# Altium schematic sheet USB.SchDoc
size A4
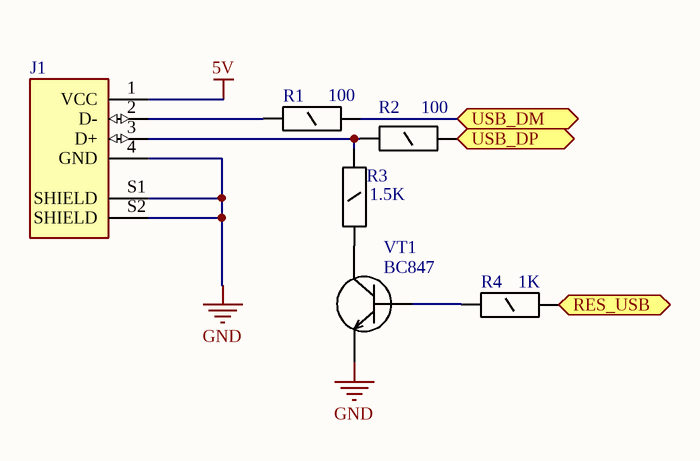
[diagram p0: USB.SchDoc]

## Parts
J1  USBB  [SAMTEC_USB-B-S-X-X-TH]  (value not drawn)
R1  100  [R_1206]
R2  100  [R_1206]
R3  1.5K  [R_1206]
R4  1K  [R_1206]
VT1  BC847  [SOT23]

## Ports
RES_USB, USB_DM, USB_DP

## Nets
5V: J1.1(VCC)
GND: J1.4(GND) J1.S1(SHIELD) J1.S2(SHIELD) VT1.2(E)
RES_USB: R4.1 ; port RES_USB
USB_DM: R1.1 ; port USB_DM
USB_DP: R2.1 ; port USB_DP
NetJ1_2: J1.2(D-) R1.2
NetJ1_3: J1.3(D+) R2.2 R3.1
NetR3_2: R3.2 VT1.3(K)
NetR4_2: R4.2 VT1.1(B)

## Library data of the parts
J1 = USB-B-S-X-X-TH: USB-B (USB TYPE-B) USB 2.0 Receptacle Connector 4 Position Through Hole, Right Angle; MF: Samtec; MP: USBB; Availability: Unavailable; Package: None; SnapEDA_Link: https://www.snapeda.com/parts/USB-B-S-S-B-TH/Samtec%20Inc./view-part/230656/?ref=snap; Value: *; Price: None; Toby_UK-Purchase-URL: https://snapeda.com/shop?store=Toby+UK&id=230656
R1-R4 = Резистор 1206: 0,25 Вт; Name: 1206; Power: 0.25 Вт; Tolerance: 5%; Voltage: 200В; Type: Резистор ЧИП; Mounting: SMD
  R1 R2: Value: 100
  R3: Value: 1.5K
  R4: Value: 1K
VT1 = BC847: NPN, SMD; Type: Биполярный NPN; Analog: KT3130; Package: SOT23; Name: BC847; Mounting: SMD